# EAGLE design espruboy (EAGLE 6.5.0)
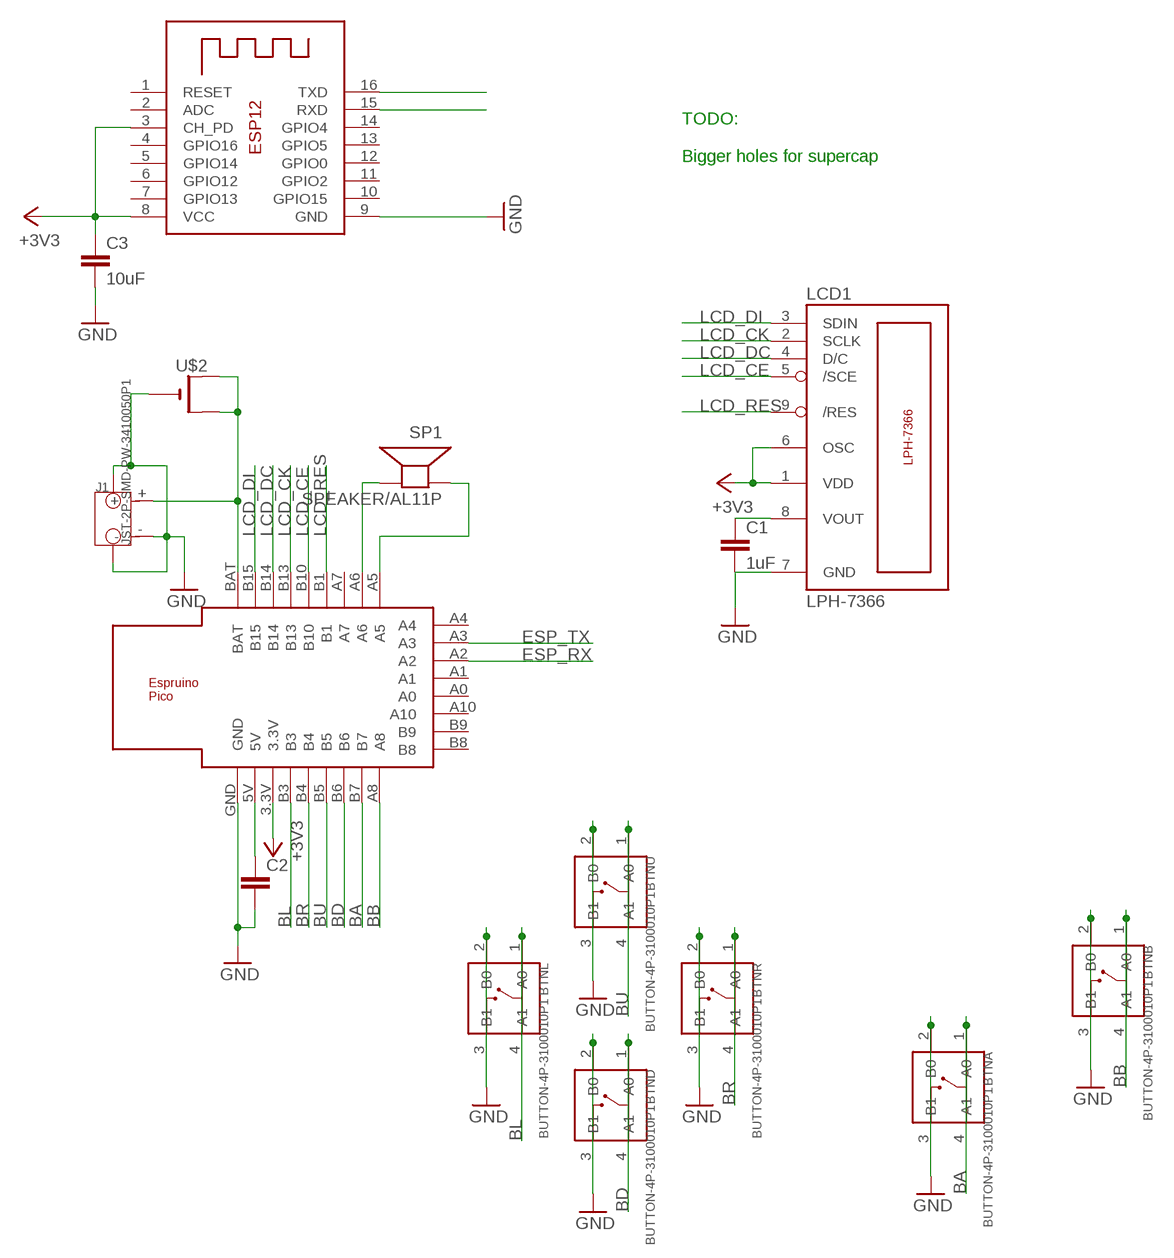
[diagram p0: schematic, sheet 1]

## Parts
BTNA  BUTTON-4P-3100010P1  [4P-SMD-6.0X6.0X5.0H]
BTNB  BUTTON-4P-3100010P1  [4P-SMD-6.0X6.0X5.0H]
BTND  BUTTON-4P-3100010P1  [4P-SMD-6.0X6.0X5.0H]
BTNL  BUTTON-4P-3100010P1  [4P-SMD-6.0X6.0X5.0H]
BTNR  BUTTON-4P-3100010P1  [4P-SMD-6.0X6.0X5.0H]
BTNU  BUTTON-4P-3100010P1  [4P-SMD-6.0X6.0X5.0H]
C1  1uF  C-EUC1206  [C1206]
C2  C-EU050-075X075  [C050-075X075]
C3  10uF  C-EUC1206  [C1206]
ESP12  ESP-12  [ESP-12]
J1  JST-2P-SMD-PW-3410050P1  [2P-SMD-2.0-90D]
LCD1  LPH-7366  [LPH-7366]
SP1  SPEAKER/AL11P  [AL11P]
U$1  ESPRUINO_PICO_SMDONLY  [ESPRUINO_PICO_SMDONLY]
U$2  CR2032SMT  [CR2032-SMD]

## Nets
+3V3: C3.1 ESP12.3(CH_PD) ESP12.8(VCC) LCD1.1(VDD) LCD1.6(OSC) U$1.3.3V
BA: BTNA.1(A0) BTNA.4(A1) U$1.B7
BB: BTNB.1(A0) BTNB.4(A1) U$1.A8
BD: BTND.1(A0) BTND.4(A1) U$1.B6
BL: BTNL.1(A0) BTNL.4(A1) U$1.B3
BR: BTNR.1(A0) BTNR.4(A1) U$1.B4
BU: BTNU.1(A0) BTNU.4(A1) U$1.B5
ESP_RX: ESP12.15(RXD) U$1.A2
ESP_TX: ESP12.16(TXD) U$1.A3
GND: BTNA.2(B0) BTNA.3(B1) BTNB.2(B0) BTNB.3(B1) BTND.2(B0) BTND.3(B1) BTNL.2(B0) BTNL.3(B1) BTNR.2(B0) BTNR.3(B1) BTNU.2(B0) BTNU.3(B1) C1.2 C2.2 C3.2 ESP12.9(GND) J1.3 J1.4 J1.- LCD1.7(GND) U$1.GND U$2.-
LCD_CE: LCD1.5(/SCE) U$1.B10
LCD_CK: LCD1.2(SCLK) U$1.B13
LCD_DC: LCD1.4(D/C) U$1.B14
LCD_DI: LCD1.3(SDIN) U$1.B15
LCD_RES: LCD1.9(/RES) U$1.B1
N$1: C1.1 LCD1.8(VOUT)
N$2: J1.+ U$1.BAT U$2.+$1(+) U$2.+$2(+1)
N$3: C2.1 U$1.5V
N$4: SP1.- U$1.A6
N$5: SP1.+ U$1.A5
Unconnected: ESP12.1(RESET) ESP12.2(ADC) ESP12.4(GPIO16) ESP12.5(GPIO14) ESP12.6(GPIO12) ESP12.7(GPIO13) ESP12.10(GPIO15) ESP12.11(GPIO2) ESP12.12(GPIO0) ESP12.13(GPIO5) ESP12.14(GPIO4) U$1.A0 U$1.A1 U$1.A4 U$1.A7 U$1.A10 U$1.B8 U$1.B9

## Notes on the sheet
- TODO:
  
  Bigger holes for supercap

## Library data of the parts
BTNA BTNB BTND BTNL BTNR BTNU = OPL Eagle Library:BUTTON-4P
C1-C3 = rcl:C-EU: CAPACITOR, European symbol
ESP12 = adafruit:ESP-12
J1 = OPL Eagle Library:JST-2P-SMD-PW
LCD1 = lph-7366:LPH-7366
SP1 = adafruit:SPEAKER: SPEAKER Source: Buerklin Added PS12 (for part # PS1240 piezo) http://www.ladyada.net/library/pcb/eaglelibrary.html
U$1 = espruino_pico:ESPRUINO_PICO_SMDONLY
U$2 = adafruit:CR2032

## Board
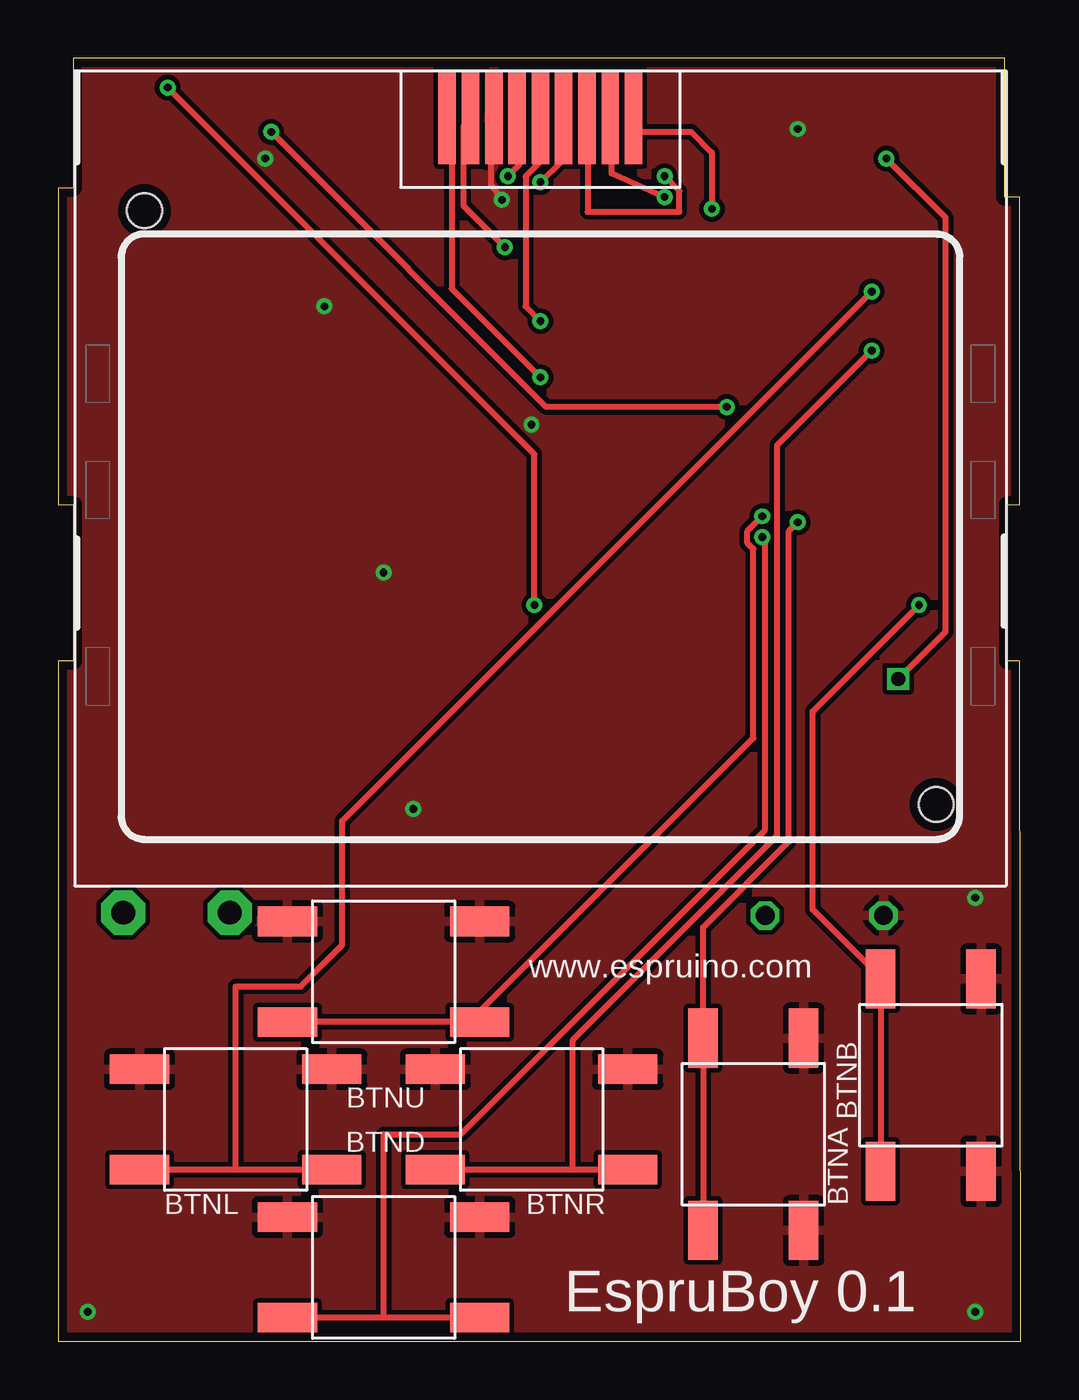
[diagram p1: board, top side]
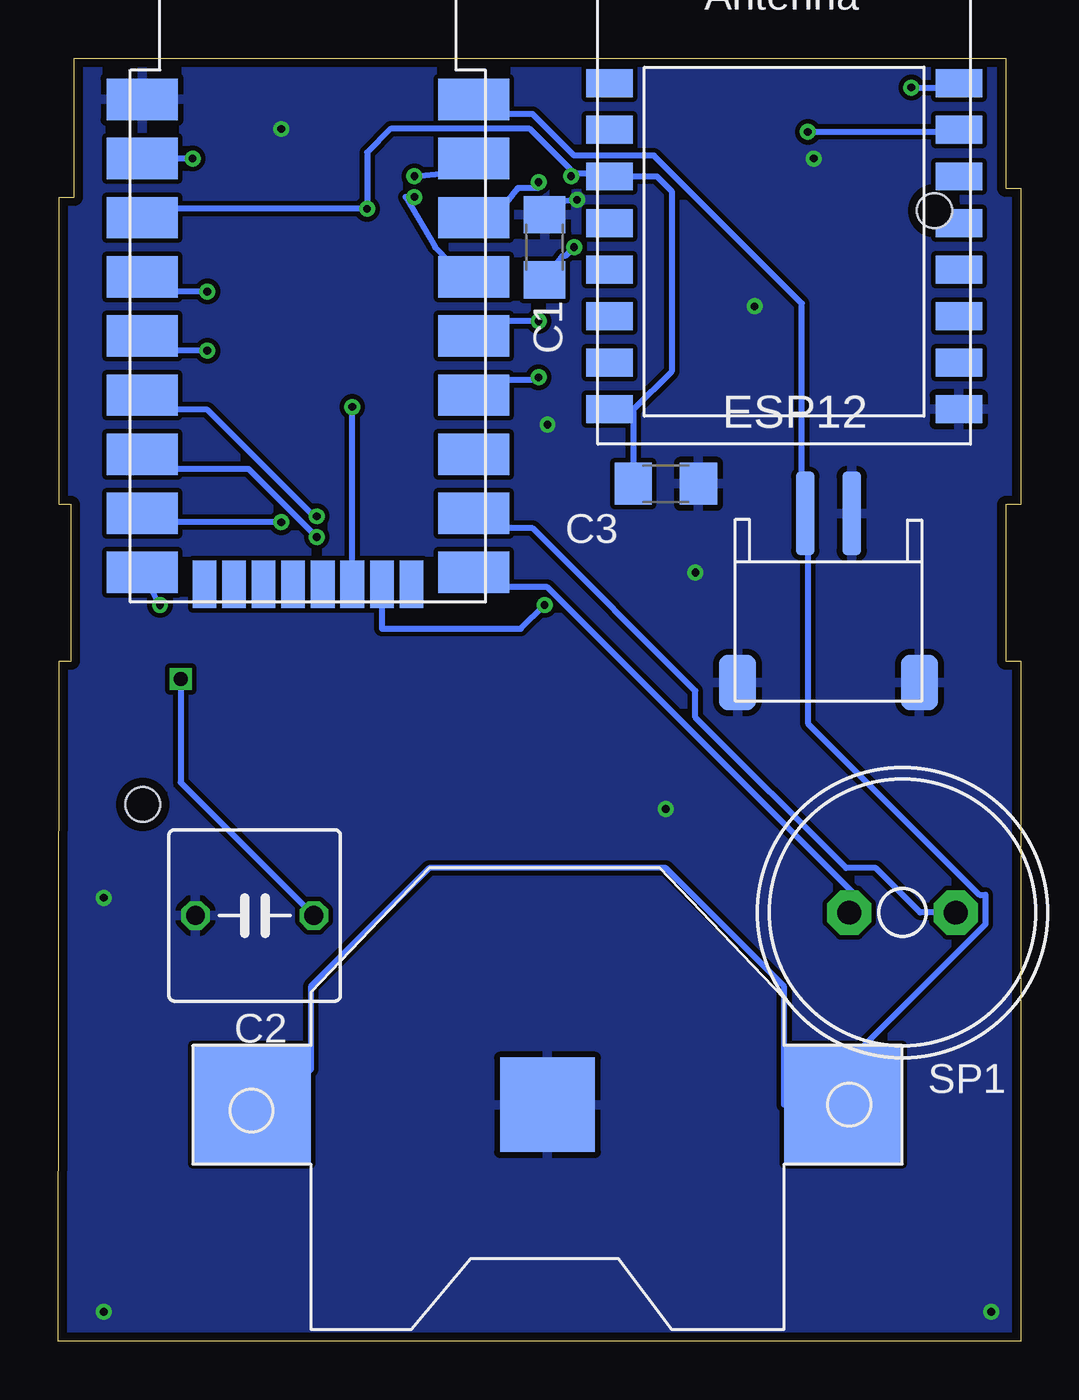
[diagram p2: board, bottom side, seen from below]

Size 41.33 x 55.11 mm. Coordinates in mm from the lower left corner, seen from the top.
Outline: 0,0 41.33,0 41.27,29.21 40.77,29.21 40.77,35.94 41.27,35.94 41.27,49.15 40.64,49.15 40.64,55.11 0.64,55.11 0.64,49.53 0,49.53 0,35.94 0.64,35.94 0.64,29.21 0,29.21 0,0
Copper layers (1*16): Top 0.0356mm / dielectric 1.5011mm / Bottom 0.0356mm
Design rules "oshpark": minimum track width 10mil, minimum drill 13mil, track to track 8mil, track to pad 6mil, pad to pad 6mil, via to via 6mil, smd to smd 6mil, copper to edge 15mil, drill to drill 6mil, minimum pad ring 7mil, minimum via ring 7mil, stop-mask expansion 4mil, vias tented up to drill 15mil, thermal gap 10mil

### Footprints (pad centres in the part's own frame; a part is rotated, then mirrored left to right if it is on the bottom)
4P-SMD-6.0X6.0X5.0H = smd 2.54 x 1.27: 1 -4.129,2.159; 2 -4.129,-2.159; 3 4.129,-2.159; 4 4.129,2.159
C1206 = smd 1.6 x 1.8: 1 -1.4,0; 2 1.4,0
C050-075X075 = drill 0.813 octagon: 1 -2.54,0; 2 2.54,0
ESP-12 = smd 2 x 1.2: 1 -7.5,4.5; 2 -7.5,2.5; 3 -7.5,0.5; 4 -7.5,-1.5; 5 -7.5,-3.5; 6 -7.5,-5.5; 7 -7.5,-7.5; 8 -7.5,-9.5; 9 7.5,-9.5; 10 7.5,-7.5; 11 7.5,-5.5; 12 7.5,-3.5; 13 7.5,-1.5; 14 7.5,0.5; 15 7.5,2.5; 16 7.5,4.5
2P-SMD-2.0-90D = smd 1.6 x 2.4: 3 3.9,-2.181; 4 -3.9,-2.181 | smd 0.8 x 3.6: + -1,5.08; - 1,5.08
LPH-7366 = smd 0.75 x 4: 1 4,17; 2 3,17; 3 2,17; 4 1,17; 5 0,17; 6 -1,17; 7 -2,17; 8 -3,17; 9 -4,17 | hole 1.5: -17,13; 17,-12.5
AL11P = drill 1.016 pad 1.905 octagon: + 2.286,0; - -2.286,0
ESPRUINO_PICO_SMDONLY = smd 1.778 x 3.048: 3.3V -8.89,-7.112; 5V -11.43,-7.112; A5 6.35,7.112; A6 3.81,7.112; A7 1.27,7.112; A8 6.35,-7.112; B1 -1.27,7.112; B3 -6.35,-7.112; B4 -3.81,-7.112; B5 -1.27,-7.112; B6 1.27,-7.112; B7 3.81,-7.112; B10 -3.81,7.112; B13 -6.35,7.112; B14 -8.89,7.112; B15 -11.43,7.112; BAT -13.97,7.112; GND -13.97,-7.112 | smd 2.032 x 1.016: A0 6.858,-0.635; A1 6.858,0.635; A2 6.858,1.905; A3 6.858,3.175; A4 6.858,4.445; A10 6.858,-1.905; B8 6.858,-4.445; B9 6.858,-3.175
CR2032-SMD = smd 5.08 x 5.08: +$1 -12.7,0; +$2 12.7,0 | smd 4.064 x 4.064: - 0,0

### Placement (x,y rotation side)
BTNA  29.84,8.89 90 top
BTNB  37.47,11.43 90 top
BTND  13.97,3.17 180 top
BTNL  7.62,9.53 180 top
BTNR  20.32,9.53 180 top
BTNU  13.97,15.88 180 top
C1  20.45,46.99 90 bottom
C2  32.89,18.29 180 bottom
C3  15.24,36.83 0 bottom
ESP12  10.16,49.53 0 bottom
J1  8.26,30.48 0 bottom
LCD1  20.7,35.56 0 top
SP1  5.08,18.41 180 bottom
U$1  30.61,39.37 270 bottom
U$2  20.32,10.16 180 bottom

### Tracks (layer width: path | path; a pad name or v marks a point on that pad's centre or on a via)
+3V3  (via drill 0.33)
  Top 0.254: v28.07,48.64 28.07,51.05 27.18,51.94 24.77,51.94 24.77,52.45 LCD1.1 | v19.3,50.04 19.81,50.55 19.81,52.45 LCD1.6
  Bottom 0.254: U$1.3.3V 36.58,48.64 v28.07,48.64 28.07,51.05 27.05,52.07 21.08,52.07 19.18,50.16 | 16.64,40.01 C3.1 | 16.64,40.01 16.89,40.01 ESP12.8 16.64,40.01 | 19.18,50.16 17.14,50.16 17.02,50.04 ESP12.3 16.89,50.04 15.62,50.04 14.99,49.4 14.99,41.66 16.64,40.01 | 19.18,50.16 v19.3,50.04
BA  (via drill 0.33)
  Top 0.254: BTNA.1 BTNA.4 27.69,17.78 31.37,21.46 31.37,34.8 v31.75,35.18
  Bottom 0.254: U$1.B7 36.58,35.18 v31.75,35.18
BB  (via drill 0.33)
  Top 0.254: BTNB.1 BTNB.4 35.31,15.62 32.38,18.54 32.38,27.05 v36.96,31.62
  Bottom 0.254: v36.96,31.62 U$1.A8
BD  (via drill 0.33)
  Top 0.254: BTND.1 13.97,1.02 | 13.97,1.02 BTND.4 | v30.23,34.54 30.35,34.42 30.35,21.97 17.27,8.89 13.97,8.89 13.97,1.02
  Bottom 0.254: U$1.B6 36.32,37.47 33.15,37.47 v30.23,34.54
BL  (via drill 0.33)
  Top 0.254: BTNL.1 7.62,7.37 | 7.62,7.37 BTNL.4 | v34.92,45.09 12.19,22.35 12.19,17.02 10.41,15.24 7.62,15.24 7.62,7.37
  Bottom 0.254: U$1.B3 36.32,45.09 v34.92,45.09
BR  (via drill 0.33)
  Top 0.254: BTNR.1 22.1,7.37 | 22.1,7.37 BTNR.4 | v34.92,42.55 30.86,38.48 30.86,21.72 22.1,12.95 22.1,7.37
  Bottom 0.254: U$1.B4 36.32,42.55 v34.92,42.55
BU  (via drill 0.33)
  Top 0.254: BTNU.4 BTNU.1 18.16,13.72 18.16,14.22 29.84,25.91 29.84,34.04 29.59,34.29 29.59,34.8 v30.23,35.43
  Bottom 0.254: U$1.B5 36.32,40.01 34.92,40.01 30.35,35.43 v30.23,35.43
ESP_RX  (via drill 0.33)
  Top 0.254: v9.14,51.94 20.95,40.13 v28.7,40.13
  Bottom 0.254: v9.14,51.94 1.91,51.94 ESP12.15 | U$1.A2 v28.7,40.13
ESP_TX  (via drill 0.33)
  Top 0.254: v4.7,53.85 20.45,38.1 v20.45,31.62
  Bottom 0.254: v4.7,53.85 2.03,53.85 1.91,53.98 ESP12.16 | v20.45,31.62 21.46,30.61 27.43,30.61 U$1.A3
GND  (via drill 0.33)
  Top 0.254: LCD1.7 18.54,52.56 18.54,51.82 18.57,49.69 v19.05,49.02
  Bottom 0.254: v19.05,49.02 20.07,48.9 C1.2
  other vias: 15.24,22.86 20.32,39.37 11.43,44.45 8.89,50.8 31.75,52.07 39.37,19.05 1.27,1.27 39.37,1.27 13.97,33.02
  pour Bottom: 0,55.88 41.91,55.88 41.91,0 0,0
  pour Top: 0,55.88 41.91,55.88 41.91,0 0,0
LCD_CE  (via drill 0.33)
  Top 0.254: v20.7,43.81 20.07,44.45 20.07,50.04 20.7,50.67 LCD1.5
  Bottom 0.254: U$1.B10 22.1,43.81 v20.7,43.81
LCD_CK  (via drill 0.33)
  Top 0.254: v26.04,49.15 23.75,50.16 23.75,52.45 LCD1.2
  Bottom 0.254: U$1.B13 23.37,46.35 24.51,46.35 25.15,46.99 26.42,49.15 v26.04,49.15
LCD_DC  (via drill 0.33)
  Top 0.254: v20.7,49.78 21.59,50.67 21.59,52.45 LCD1.4
  Bottom 0.254: U$1.B14 22.1,48.9 21.59,49.53 20.7,49.53 v20.7,49.78
LCD_DI  (via drill 0.33)
  Top 0.254: v26.04,50.04 26.67,49.4 26.67,48.51 22.73,48.51 22.73,52.45 LCD1.3
  Bottom 0.254: U$1.B15 23.37,50.16 24.64,50.16 v26.04,50.04
LCD_RES  (via drill 0.33)
  Top 0.254: v20.7,41.4 16.89,45.21 16.89,52.32 16.76,52.45 LCD1.9
  Bottom 0.254: U$1.B1 22.1,41.27 20.83,41.27 v20.7,41.4
N$1  (via drill 0.33)
  Top 0.254: v19.18,46.99 17.4,48.77 17.4,52.2 17.65,52.45 LCD1.8
  Bottom 0.254: C1.1 19.68,46.61 19.56,46.61 v19.18,46.99
N$2
  Bottom 0.254: U$2.+$2 32,10.16 30.48,11.68 30.48,15.24 25.4,20.32 15.24,20.32 10.16,15.24 10.16,10.16 U$2.+$1 8.38,11.05 1.52,17.91 1.52,19.18 1.78,19.18 9.14,26.54 9.14,35.56 J1.+ 9.4,35.56 9.4,44.58 15.75,50.93 19.18,50.93 20.95,52.7 22.1,52.7 U$1.BAT
N$3  (via drill 0.33, 0.6)
  Top 0.254: v36.07,28.45 38.1,30.48 38.1,48.26 v35.56,50.8
  Bottom 0.254: C2.1 36.07,24 v36.07,28.45 | v35.56,50.8 U$1.5V
N$4
  Bottom 0.254: U$1.A6 22.1,34.92 20.95,34.92 13.97,27.94 13.97,26.8 7.49,20.32 6.22,20.32 4.32,18.41 SP1.-
N$5
  Bottom 0.254: U$1.A5 22.1,32.38 20.32,32.38 7.24,19.3 7.24,18.41 SP1.+

### Text on the board
tNames: www.espruino.com | EspruBoy 0.1